# Altium schematic sheet APP_1_PLL_m.SchDoc
size Tabloid; SheetNumber: 13; SheetTotal: 14; Sheet_Name: PLL; Size: 11x17
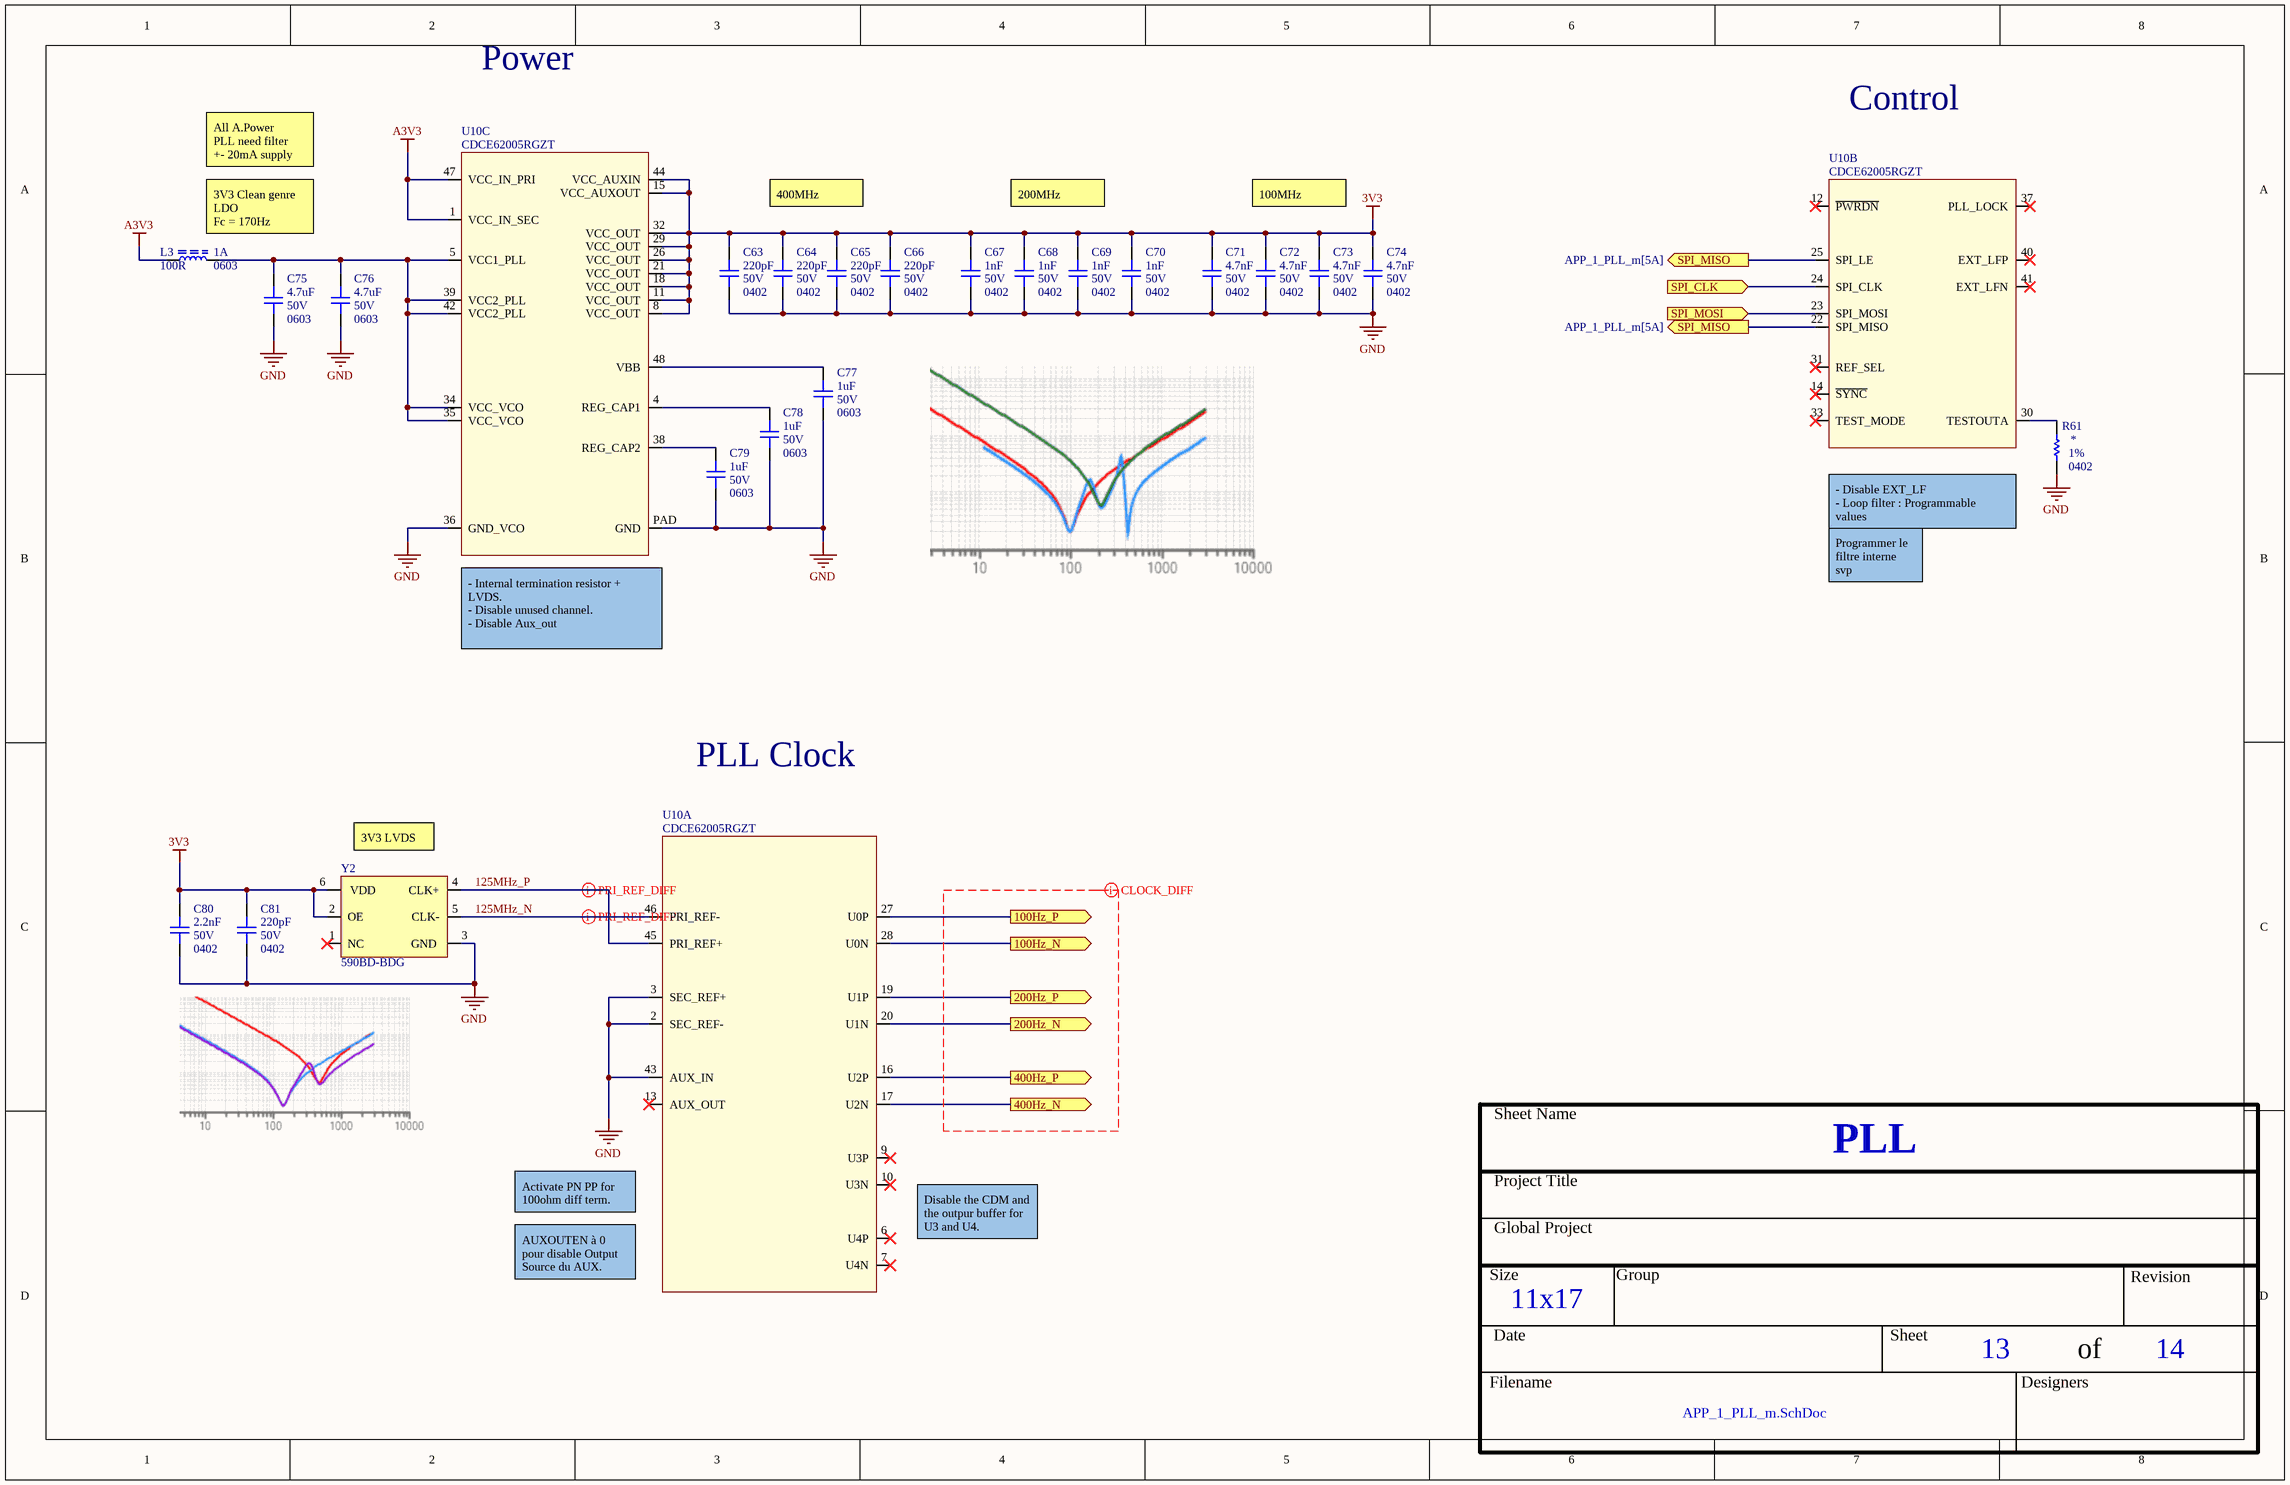
[diagram p0: APP_1_PLL_m.SchDoc]

## Parts
C63  value 220pF  Voltage: 50V  Package: 0402  [CAP_0402]  (hidden comment: CAP - 0402)
C64  value 220pF  Voltage: 50V  Package: 0402  [CAP_0402]  (hidden comment: CAP - 0402)
C65  value 220pF  Voltage: 50V  Package: 0402  [CAP_0402]  (hidden comment: CAP - 0402)
C66  value 220pF  Voltage: 50V  Package: 0402  [CAP_0402]  (hidden comment: CAP - 0402)
C67  value 1nF  Voltage: 50V  Package: 0402  [CAP_0402]  (hidden comment: CAP - 0402)
C68  value 1nF  Voltage: 50V  Package: 0402  [CAP_0402]  (hidden comment: CAP - 0402)
C69  value 1nF  Voltage: 50V  Package: 0402  [CAP_0402]  (hidden comment: CAP - 0402)
C70  value 1nF  Voltage: 50V  Package: 0402  [CAP_0402]  (hidden comment: CAP - 0402)
C71  value 4.7nF  Voltage: 50V  Package: 0402  [CAP_0402]  (hidden comment: CAP - 0402)
C72  value 4.7nF  Voltage: 50V  Package: 0402  [CAP_0402]  (hidden comment: CAP - 0402)
C73  value 4.7nF  Voltage: 50V  Package: 0402  [CAP_0402]  (hidden comment: CAP - 0402)
C74  value 4.7nF  Voltage: 50V  Package: 0402  [CAP_0402]  (hidden comment: CAP - 0402)
C75  value 4.7uF  Voltage: 50V  Package: 0603  [CAP_0603]  (hidden comment: CAP - 0603)
C76  value 4.7uF  Voltage: 50V  Package: 0603  [CAP_0603]  (hidden comment: CAP - 0603)
C77  value 1uF  Voltage: 50V  Package: 0603  [CAP_0603]  (hidden comment: CAP - 0603)
C78  value 1uF  Voltage: 50V  Package: 0603  [CAP_0603]  (hidden comment: CAP - 0603)
C79  value 1uF  Voltage: 50V  Package: 0603  [CAP_0603]  (hidden comment: CAP - 0603)
C80  value 2.2nF  Voltage: 50V  Package: 0402  [CAP_0402]  (hidden comment: CAP - 0402)
C81  value 220pF  Voltage: 50V  Package: 0402  [CAP_0402]  (hidden comment: CAP - 0402)
L3  value 100R  Current: 1A  Package: 0603  [FER_0603]  (hidden comment: FER - 0603)
R61  Package: 0402  Precision: 1%  [RES_0402]  (hidden comment: RES - 0402)
U10  CDCE62005RGZT  [TIM_CDCE62005RGZT]  (parts A,B,C of 3)
Y2  590BD-BDG  [OSC_590BD-BDG]

## Ports
100Hz_N (out), 100Hz_P (out), 200Hz_N (out), 200Hz_P (out), 400Hz_N (out), 400Hz_P (out), SPI_CLK (in), SPI_MISO (out, see APP_1_PLL_m[5A]), SPI_MOSI (in)

## Nets
3V3: C63.2 C64.2 C65.2 C66.2 C67.2 C68.2 C69.2 C70.2 C71.2 C72.2 C73.2 C74.2 C80.2 C81.2 U10.8(VCC_OUT) U10.11(VCC_OUT) U10.15(VCC_AUXOUT) U10.18(VCC_OUT) U10.21(VCC_OUT) U10.26(VCC_OUT) U10.29(VCC_OUT) U10.32(VCC_OUT) U10.44(VCC_AUXIN) Y2.2(OE) Y2.6(VDD)
A3V3: L3.2 U10.1(VCC_IN_SEC) U10.47(VCC_IN_PRI)
GND: C63.1 C64.1 C65.1 C66.1 C67.1 C68.1 C69.1 C70.1 C71.1 C72.1 C73.1 C74.1 C75.1 C76.1 C77.1 C78.1 C79.1 C80.1 C81.1 R61.1 U10.2(SEC_REF-) U10.3(SEC_REF+) U10.36(GND_VCO) U10.43(AUX_IN) U10.PAD(GND) Y2.3(GND)
100Hz_N: U10.28(U0N) ; port 100Hz_N
100Hz_P: U10.27(U0P) ; port 100Hz_P
125MHz_N: U10.46(PRI_REF-) Y2.5(CLK-)
125MHz_P: U10.45(PRI_REF+) Y2.4(CLK+)
200Hz_N: U10.20(U1N) ; port 200Hz_N
200Hz_P: U10.19(U1P) ; port 200Hz_P
400Hz_N: U10.17(U2N) ; port 400Hz_N
400Hz_P: U10.16(U2P) ; port 400Hz_P
SPI_CLK: U10.24(SPI_CLK) ; port SPI_CLK
SPI_MISO: U10.22(SPI_MISO) U10.25(SPI_LE) ; port SPI_MISO
SPI_MOSI: U10.23(SPI_MOSI) ; port SPI_MOSI
NetC75_2: C75.2 C76.2 L3.1 U10.5(VCC1_PLL) U10.34(VCC_VCO) U10.35(VCC_VCO) U10.39(VCC2_PLL) U10.42(VCC2_PLL)
NetC77_2: C77.2 U10.48(VBB)
NetC78_2: C78.2 U10.4(REG_CAP1)
NetC79_2: C79.2 U10.38(REG_CAP2)
NetR61_2: R61.2 U10.30(TESTOUTA)

Not connected (* = marked no-connect by the designer): U10 6(U4P)* 7(U4N)* 9(U3P)* 10(U3N)* 12(~{PWRDN})* 13(AUX_OUT)* 14(~{SYNC})* 31(REF_SEL)* 33(TEST_MODE)* 37(PLL_LOCK)* 40(EXT_LFP)* 41(EXT_LFN)*; Y2 1(NC)*

## Layout directives
differential pair: 125MHz_N, 125MHz_P, (no net found under the mark)

## Notes on the sheet
- Power
- All A.Power
  PLL need filter
  +- 20mA supply
- Control
- (near L3) 3V3 Clean genre LDO
  Fc = 170Hz
- 400MHz
- 200MHz
- 100MHz
- - Disable EXT_LF
  - Loop filter : Programmable values
  - Can program PLL_Lock
- Programmer le filtre interne svp
- (near U10) - Internal termination resistor + LVDS.
  - Disable unused channel.
  - Disable Aux_out
- PLL Clock
- (near Y2) 3V3 LVDS
- (near U10) Activate PN PP for 100ohm diff term.
- (near U10) Disable the CDM and the outpur buffer for U3 and U4.
- (near U10) AUXOUTEN à 0 pour disable Output Source du AUX.
- Sheet Name
- Project Title
- Global Project
- Size
- Group
- Revision
- Date
- Sheet
- of
- Filename
- Designers

## Library data of the parts
C63-C74 C80 C81 = CAP - 0402: Precision: 10%; Current: *; CreatedBy: Jonathan Bouchard; Power: *
C75-C79 = CAP - 0603: Precision: 10%; Current: *; CreatedBy: Jonathan Bouchard; Power: *
R61 = RES - 0402: Voltage: 50V; Power: 1/16W; Current: *; CreatedBy: Jonathan Bouchard; Value: *
U10 = TIM_CDCE62005RGZT: TIM - CLK SYNTH JITTER CLEANER 3:5 - QFN-48; Voltage: 3 V ~ 3.6 V; Mfg: Texas Instruments; Current: *; Power: *; Mfg Part Number: CDCE62005RGZT; HelpURL: http://www.ti.com/lit/ds/symlink/cdce62005.pdf; CreatedBy: Jonathan Bouchard; Temperature: -40°C ~ 85°C; Value: *; Precision: *; Package: QFN-48; Supplier 1: Digikey; Supplier Part Number 1: 296-23947-1-ND
Y2 = OSC_590BD-BDG: TIM - OSC PROG 125MHz ~ 214.999MHz LVDS 3.3V 7PPM EN/DS - 6-SMD; Manufacturer #1: Silicon Labs; Current Rating: 100 mA (supply); Note: Spécifié la fréquence lors de la commande; Voltage rating: 3.3V (supply); Polarized: Yes; Value: ±7ppm (freq Stability), ±20ppm (freq stability total); Magnetic Material: UNKNOWN; GRAMS Lib Spec: 2.8; Manufacturer #2: *; Power Max: *; Part Number #1: 590BD-BDG; Part Number #2: *; HelpURL: https://www.silabs.com/documents/public/data-sheets/Si590-591.pdf; Supplier 1: Digi-Key; Supplier Part Number 1: 590BD-BDG-ND; Assembly Type: SMD; Temperature: -40°C ~ 85°C; Package: 6-SMD; CreatedBy/Date: from 590BD-CDG; Tolerance: *; VerifiedBy: Caroline Paulin / 3/10/2019; Cryo: UNKNOWN
L3 = FER - 0603: Voltage: *; CreatedBy: Jonathan Bouchard; Power: *; Precision: *